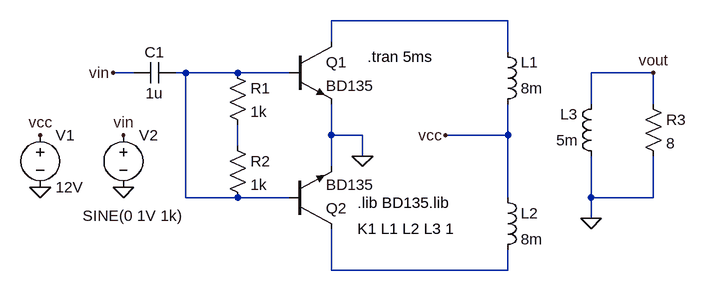
[diagram p0: schematic transformer_coupled_class_B.asc]
transformer_coupled_class_B.asc, the LTspice schematic file:
Version 4.1
SHEET 1 920 680
WIRE 640 -80 368 -80
WIRE 368 -48 368 -80
WIRE 640 -32 640 -80
WIRE 64 0 32 0
WIRE 144 0 128 0
WIRE 224 0 144 0
WIRE 304 0 224 0
WIRE 864 0 768 0
WIRE 768 48 768 0
WIRE 864 48 864 0
WIRE 368 96 368 48
WIRE 416 96 368 96
WIRE 640 96 640 48
WIRE 640 96 544 96
WIRE 224 112 224 80
WIRE 416 128 416 96
WIRE 368 144 368 96
WIRE 144 192 144 0
WIRE 224 192 144 192
WIRE 304 192 224 192
WIRE 640 192 640 96
WIRE 768 192 768 128
WIRE 864 192 864 128
WIRE 864 192 768 192
WIRE 768 224 768 192
WIRE 368 304 368 240
WIRE 640 304 640 272
WIRE 640 304 368 304
FLAG -80 96 vcc
FLAG 416 128 0
FLAG 544 96 vcc
FLAG 48 96 vin
FLAG 48 176 0
FLAG -80 176 0
FLAG 864 0 vout
FLAG 768 224 0
FLAG 32 0 vin
SYMBOL voltage -80 80 R0
WINDOW 123 0 0 Left 0
WINDOW 39 0 0 Left 0
SYMATTR InstName V1
SYMATTR Value 12V
SYMBOL npn 304 -48 R0
SYMATTR InstName Q1
SYMATTR Value BD135
SYMBOL npn 304 240 M180
SYMATTR InstName Q2
SYMATTR Value BD135
SYMBOL ind 624 64 M180
WINDOW 0 36 80 Left 2
WINDOW 3 36 40 Left 2
SYMATTR InstName L1
SYMATTR Value 8m
SYMATTR Type ind
SYMBOL ind 784 144 R180
WINDOW 0 36 80 Left 2
WINDOW 3 36 40 Left 2
SYMATTR InstName L3
SYMATTR Value 5m
SYMATTR Type ind
SYMBOL voltage 48 80 R0
WINDOW 3 -63 140 Left 2
WINDOW 123 0 0 Left 0
WINDOW 39 0 0 Left 0
SYMATTR InstName V2
SYMATTR Value SINE(0 1V 1k)
SYMBOL res 848 32 R0
SYMATTR InstName R3
SYMATTR Value 8
SYMBOL ind 624 176 R0
SYMATTR InstName L2
SYMATTR Value 8m
SYMATTR Type ind
SYMBOL res 208 -16 R0
SYMATTR InstName R1
SYMATTR Value 1k
SYMBOL res 208 96 R0
SYMATTR InstName R2
SYMATTR Value 1k
SYMBOL cap 128 -16 R90
WINDOW 0 0 32 VBottom 2
WINDOW 3 32 32 VTop 2
SYMATTR InstName C1
SYMATTR Value 1u
TEXT 408 240 Left 2 !K1 L1 L2 L3 1
TEXT 424 -25 Left 2 !.tran 5ms
TEXT 408 200 Left 2 !.lib BD135.lib

The netlist it stands for:
* transformer_coupled_class_B.asc
V1 vcc 0 12V
Q1 N001 N002 0 0 BD135
Q2 N004 N002 0 0 BD135
L1 vcc N001 8m
L3 0 vout 5m
V2 vin 0 SINE(0 1V 1k)
R3 vout 0 8
L2 vcc N004 8m
R1 N002 N003 1k
R2 N003 N002 1k
C1 N002 vin 1u
.model NPN NPN
.model PNP PNP
.lib standard.bjt
K1 L1 L2 L3 1
.tran 5ms
.lib BD135.lib
.backanno
.end